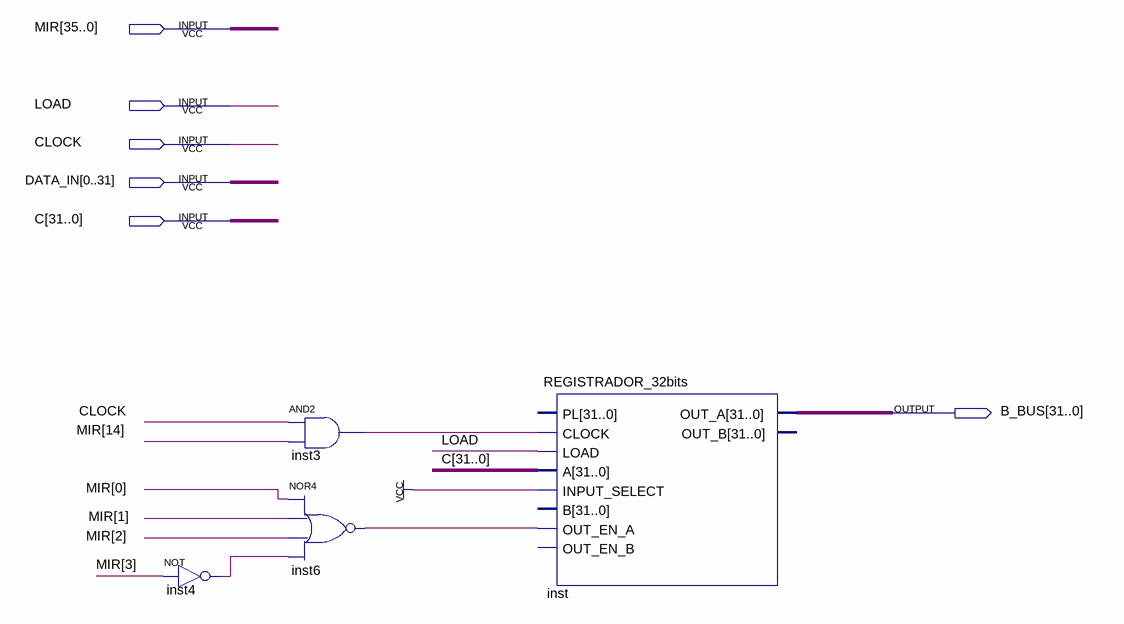
[diagram p0: schematic sheet]
// Quartus schematic OPC.bdf as structural Verilog: 4 symbols, 6 pins
module OPC (
  input  [35:0] MIR,
  input  LOAD,
  input  CLOCK,
  input  [0:31] DATA_IN,
  input  [31:0] C,
  output [31:0] B_BUS
);

  wire inst3_out, inst4_out, inst6_out;

  not inst4 (inst4_out, MIR[3]);
  and inst3 (inst3_out, CLOCK, MIR[14]);
  nor inst6 (inst6_out, MIR[0], MIR[1], MIR[2], inst4_out);
  REGISTRADOR_32bits inst (
    .CLOCK(inst3_out), .LOAD(LOAD), .A(C), .INPUT_SELECT(1'b1), .OUT_EN_A(inst6_out), .OUT_A(B_BUS));  // open: PL, B, OUT_EN_B, OUT_B
endmodule
